# EAGLE design breakout_022218 (EAGLE 8.6.0)
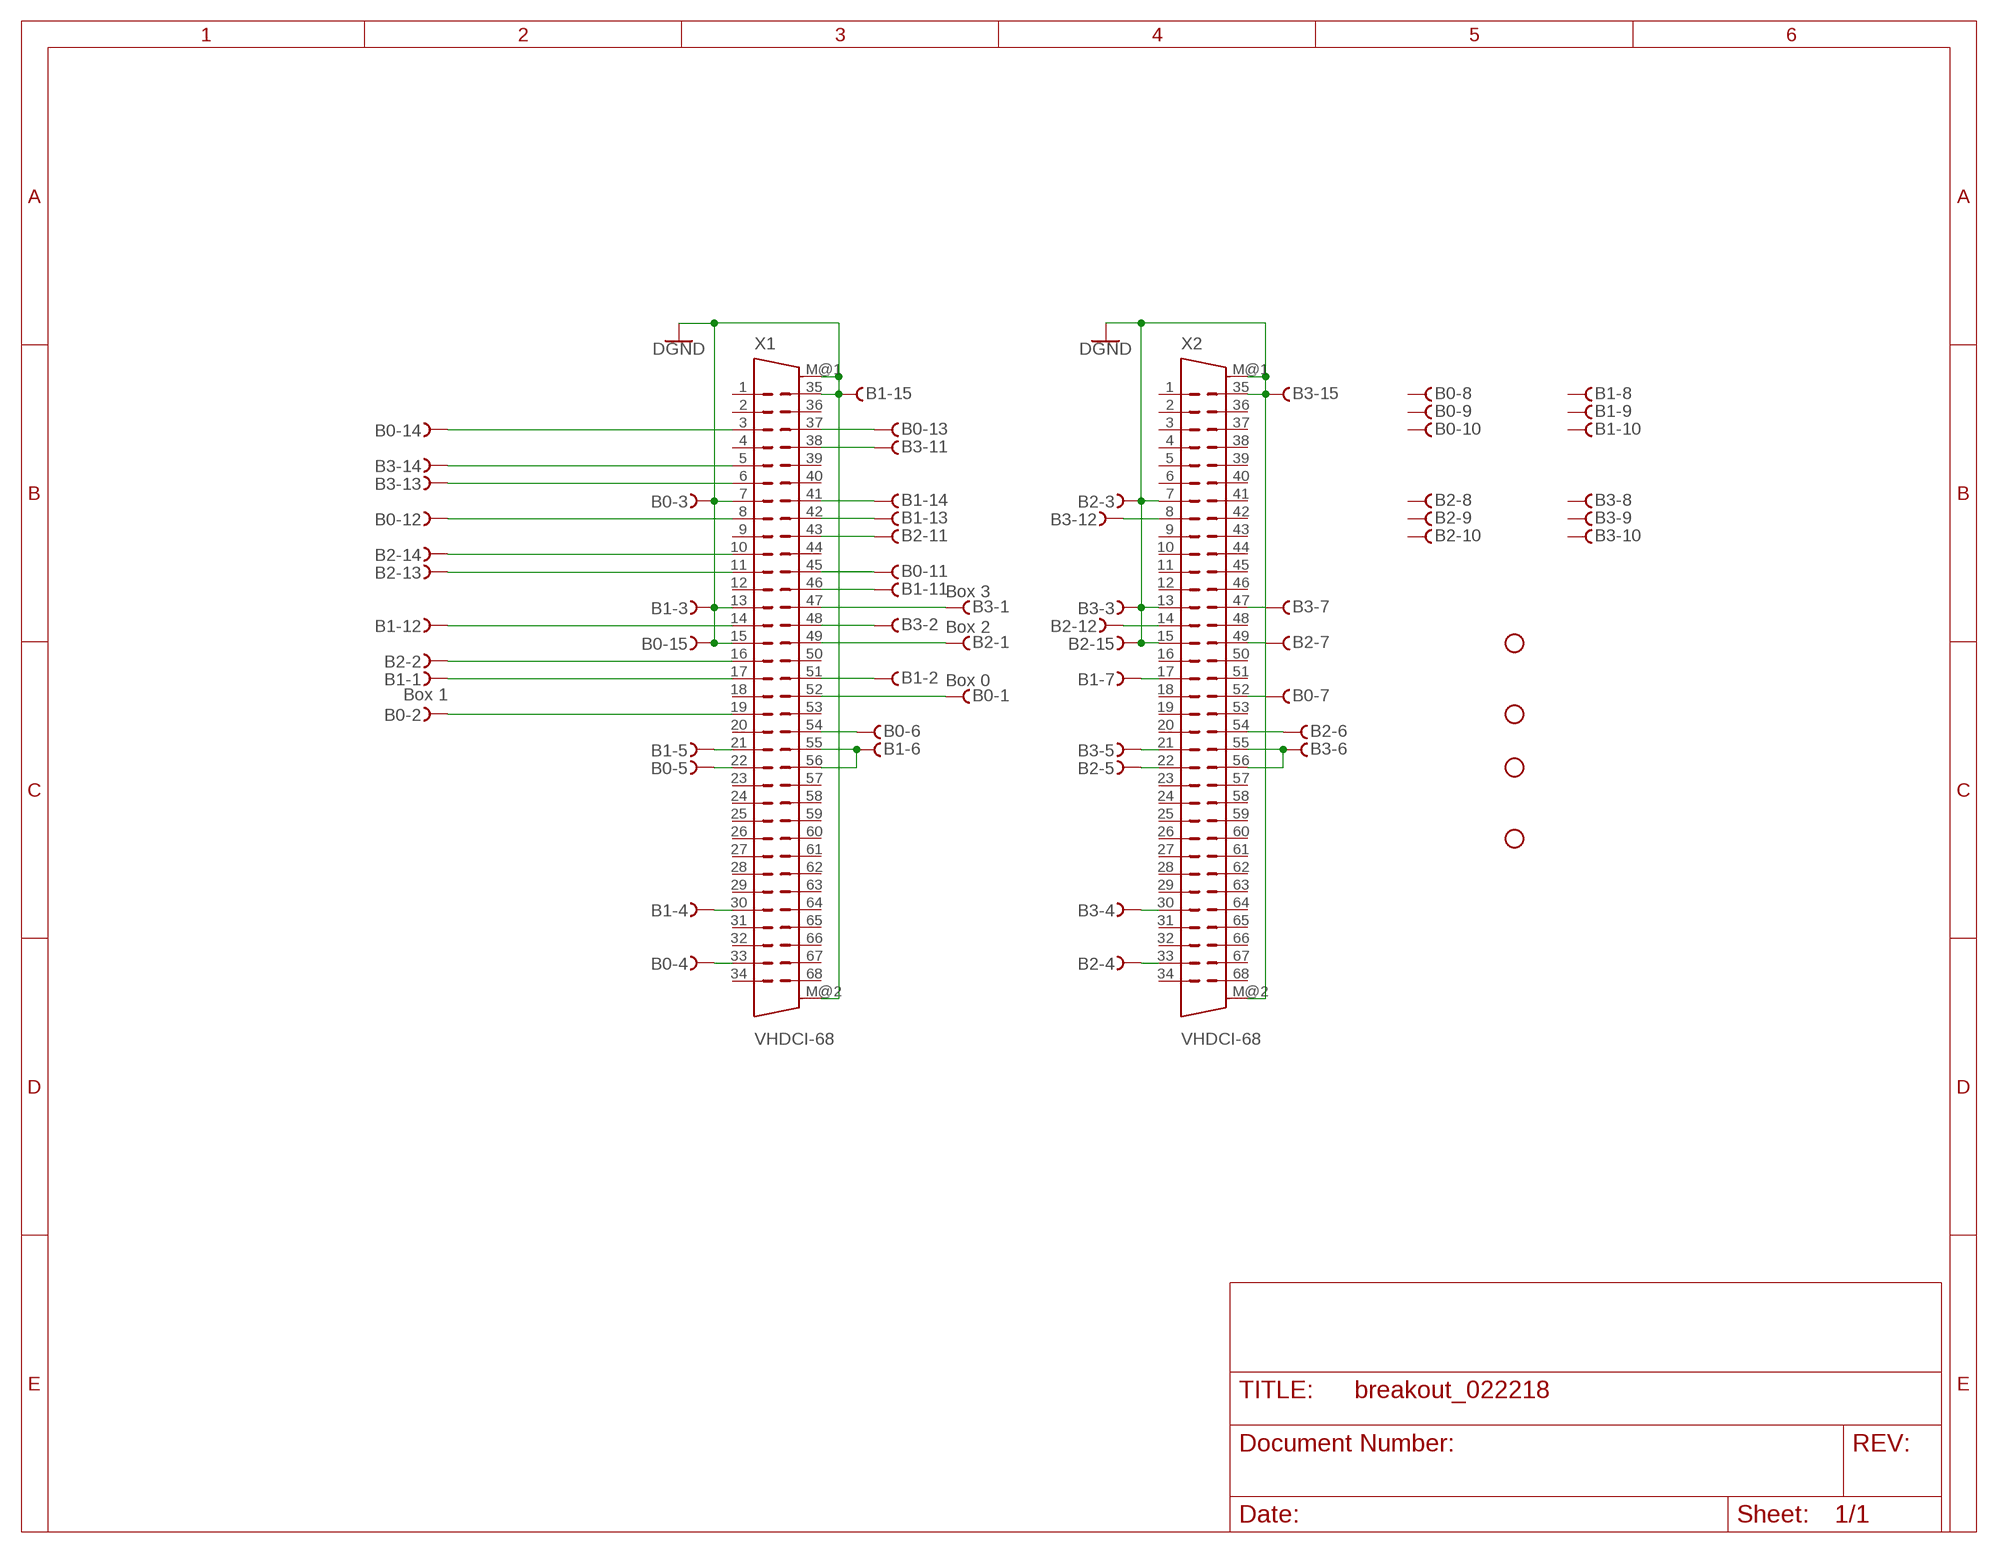
[diagram p0: schematic, sheet 1]

## Parts
B0  Box 0  D-SUB15-HDR15RA  [HDR15RA]
B1  Box 1  D-SUB15-HDR15RA  [HDR15RA]
B2  Box 2  D-SUB15-HDR15RA  [HDR15RA]
B3  Box 3  D-SUB15-HDR15RA  [HDR15RA]
H1  STAND-OFF  [STAND-OFF]
H2  STAND-OFF  [STAND-OFF]
H3  STAND-OFF  [STAND-OFF]
H4  STAND-OFF  [STAND-OFF]
X1  VHDCI-68  [VHDCI-68]
X2  VHDCI-68  [VHDCI-68]

## Nets
GND: B0.3 B0.15 B1.3 B1.15 B2.3 B2.15 B3.3 B3.15 X1.7 X1.13 X1.15 X1.35 X1.M@1(S) X1.M@2(S) X2.7 X2.13 X2.15 X2.35 X2.M@1(S) X2.M@2(S) ; supply symbol labelled DGND
N$1: B0.6 X1.54
N$2: B1.6 X1.55 X1.56
N$3: B2.6 X2.54
N$4: B3.6 X2.55 X2.56
N$5: B0.5 X1.22
N$6: B1.5 X1.21
N$7: B2.5 X2.22
N$8: B3.5 X2.21
N$9: B0.4 X1.33
N$10: B1.4 X1.30
N$11: B2.4 X2.33
N$12: B3.4 X2.30
N$13: B0.1 X1.52
N$14: B1.1 X1.17
N$15: B2.1 X1.49
N$16: B3.1 X1.47
N$17: B0.2 X1.19
N$18: B1.2 X1.51
N$19: B2.2 X1.16
N$20: B3.2 X1.48
N$21: B3.12 X2.8
N$22: B2.12 X2.14
N$25: B0.7 X2.52
N$26: B1.7 X2.17
N$27: B2.7 X2.49
N$28: B3.7 X2.47
N$33: B0.12 X1.8
N$34: B1.12 X1.14
N$37: B0.11 X1.45
N$38: B1.11 X1.46
N$39: B2.11 X1.43
N$40: B3.11 X1.38
N$41: B0.13 X1.37
N$42: B1.13 X1.42
N$43: B2.13 X1.11
N$44: B3.13 X1.6
N$45: B0.14 X1.3
N$46: B1.14 X1.41
N$47: B2.14 X1.10
N$48: B3.14 X1.5
Unconnected: B0.8 B0.9 B0.10 B1.8 B1.9 B1.10 B2.8 B2.9 B2.10 B3.8 B3.9 B3.10 X1.1 X1.2 X1.4 X1.9 X1.12 X1.18 X1.20 X1.23 X1.24 X1.25 X1.26 X1.27 X1.28 X1.29 X1.31 X1.32 X1.34 X1.36 X1.39 X1.40 X1.44 X1.50 X1.53 X1.57 X1.58 X1.59 X1.60 X1.61 X1.62 X1.63 X1.64 X1.65 X1.66 X1.67 X1.68 X2.1 X2.2 X2.3 X2.4 X2.5 X2.6 X2.9 X2.10 X2.11 X2.12 X2.16 X2.18 X2.19 X2.20 X2.23 X2.24 X2.25 X2.26 X2.27 X2.28 X2.29 X2.31 X2.32 X2.34 X2.36 X2.37 X2.38 X2.39 X2.40 X2.41 X2.42 X2.43 X2.44 X2.45 X2.46 X2.48 X2.50 X2.51 X2.53 X2.57 X2.58 X2.59 X2.60 X2.61 X2.62 X2.63 X2.64 X2.65 X2.66 X2.67 X2.68

## Library data of the parts
B0 B1-B3 = con-thomas-betts:D-SUB15-: D-Subminiatur Connector Source: Electronioc Interconnects European Edition 1998; OC_FARNELL: unknown; OC_NEWARK: unknown
H1-H4 = SparkFun-Hardware:STAND-OFF: Stand Off Drill holes for mechanically mounting via screws, standoffs, etc. Note: Use the keepout ring to avoid running the screw head into surrounding components. Variant Overviews STAND-OFF - Mechanical footprint for a #4 phillips button head screw. STAND-OFF-TIGHT - Mechanical footprint for a #4 phillips button head screw, Example SparkFun Products Screw - Phillips Head (1/4", 4-40, 10 pack) <https://www.sparkfun.com/products/10453> (PRT-10453) Screw - Phillips Head (1/2", 4-40, 10 pack) <https://www.sparkfun.com/products/10452> (PRT-10452) Screw - Phillips Head (3/4", 4-40, 10 pack) <https://www.sparkfun.com/products/10451> (PRT-10451) Screw - Phillips Head (1", 4-40, 10 pack) <https://www.sparkfun.com/products/10450> (PRT-10450)
X1 X2 = con-molex:VHDCI-68: VHDCI RIGHT ANGLE ASSEMBLY 68-Pin 73412-0110 86-Pin-VHDCI-Anschluss (rechtwinklig) Source: Data sheet <ftp://ftp.ni.com/ddraw/CU_68-Pin_Right-Angle_VHDCI_Connector.pdf>; MF: MOLEX

## Board
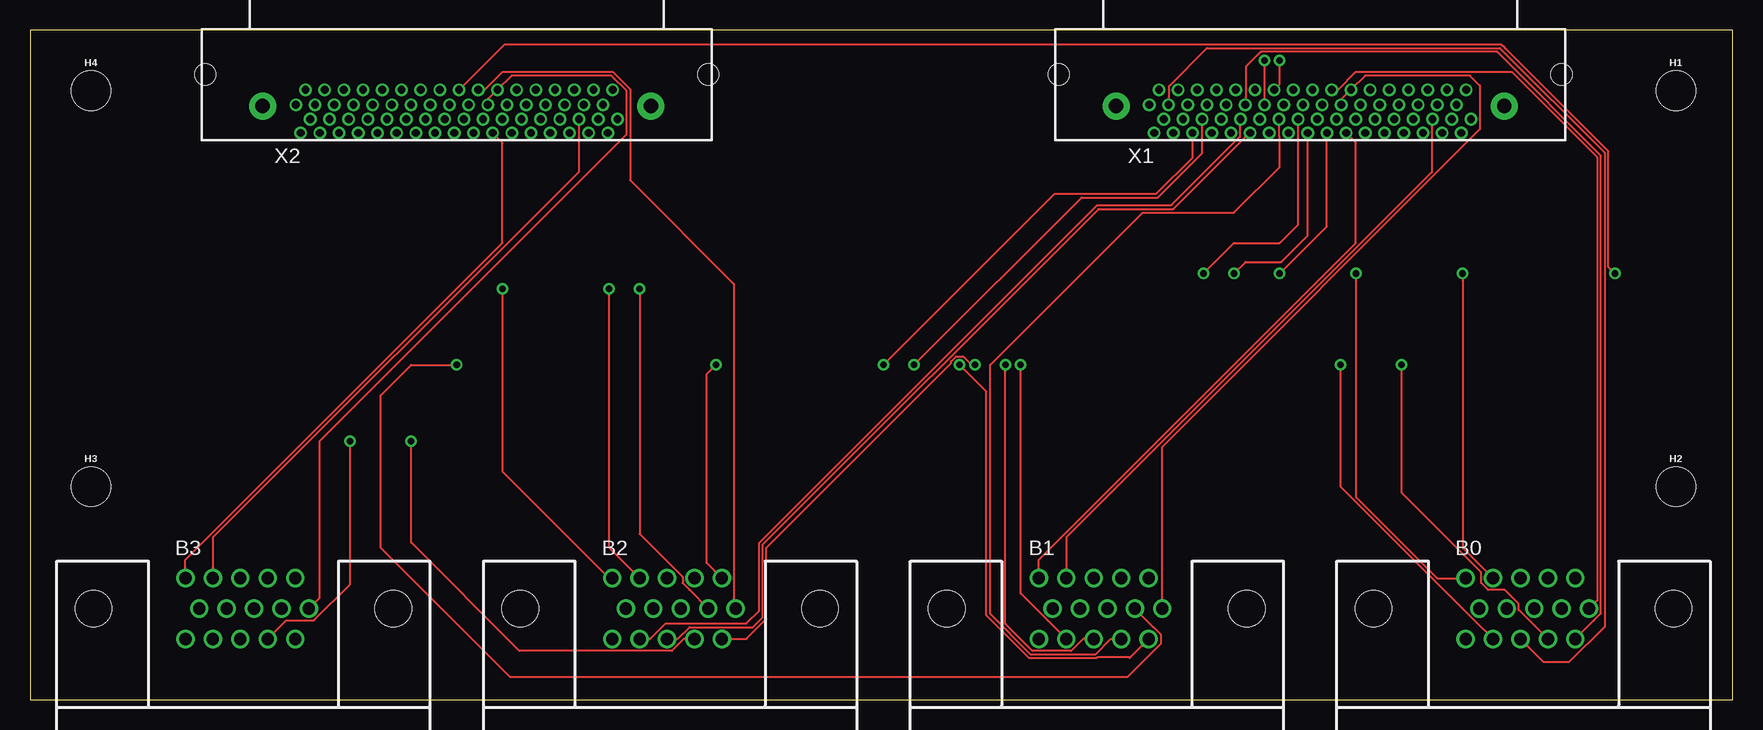
[diagram p1: board, top side]
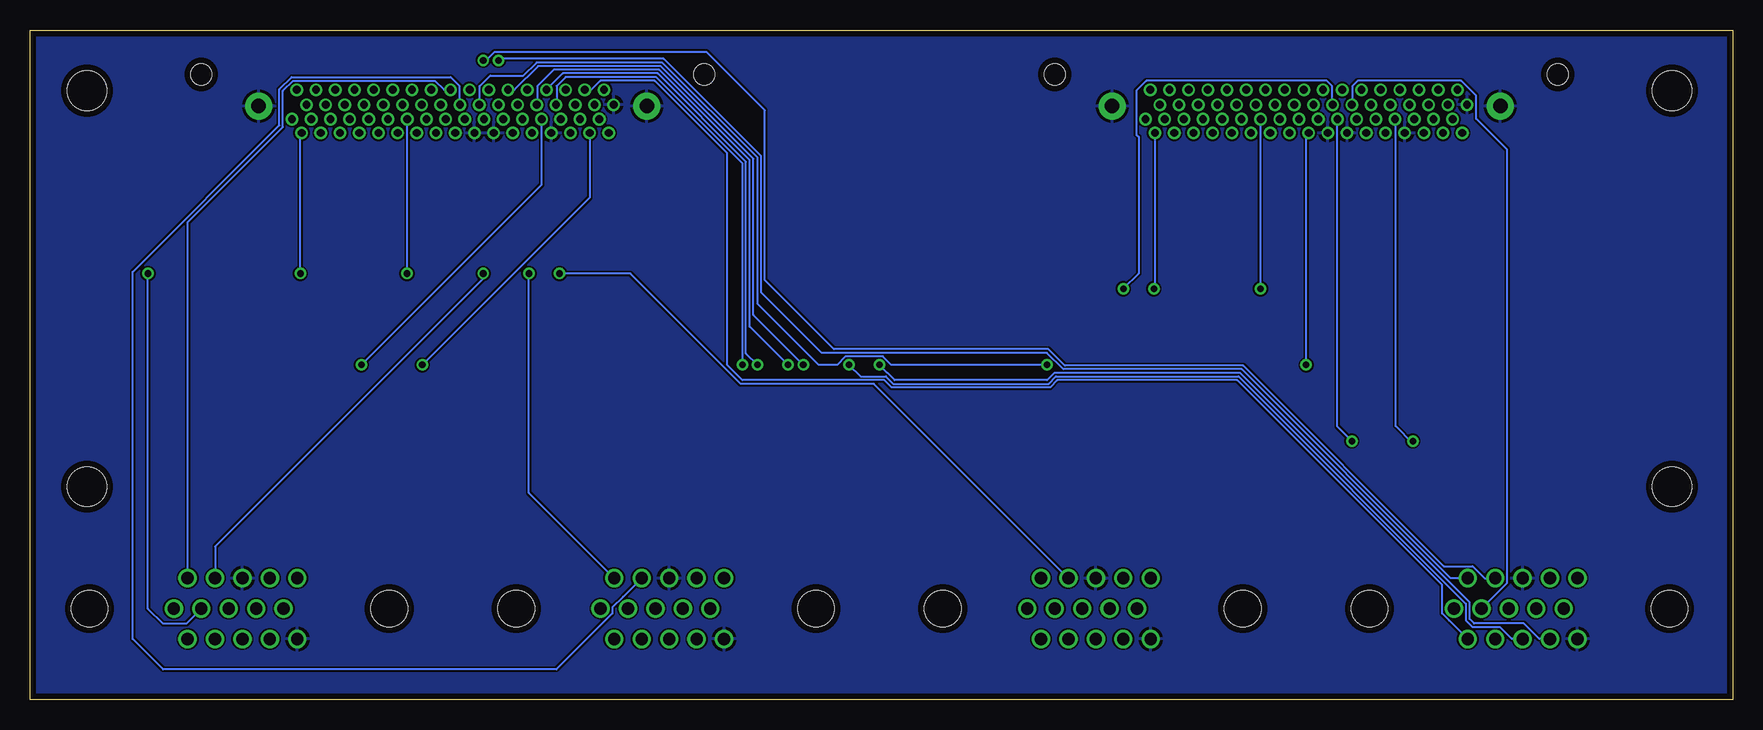
[diagram p2: board, bottom side, seen from below]

Size 141.91 x 55.87 mm. Coordinates in mm from the lower left corner, seen from the top.
Outline: 0,0 141.91,0 141.91,55.87 0,55.87 0,0
Copper layers (1*16): Top 0.0178mm / dielectric 59mil / Bottom 0.0178mm
Design rules "SSC-EAGLE-2Lyr_v1.0.0.3": minimum track width 6mil, minimum drill 14mil, track to track 6mil, track to pad 6mil, pad to pad 6mil, via to via 6mil, smd to smd 6mil, copper to edge 20mil, drill to drill 16mil, minimum pad ring 8mil, minimum via ring 8mil, stop-mask expansion 3mil, vias tented up to drill 0mil, thermal gap 10mil

### Footprints (pad centres in the part's own frame; a part is rotated, then mirrored left to right if it is on the bottom)
HDR15RA = drill 1.016: 1 4.318,2.54; 2 2.032,2.54; 3 -0.254,2.54; 4 -2.54,2.54; 5 -4.826,2.54; 6 5.461,0; 7 3.175,0; 8 0.889,0; 9 -1.397,0; 10 -3.683,0; 11 4.318,-2.54; 12 2.032,-2.54; 13 -0.254,-2.54; 14 -2.54,-2.54; 15 -4.826,-2.54 | hole 3.048: -12.497,0; 12.497,0
STAND-OFF = hole 3.302: 0,0
VHDCI-68 = drill 0.65 pad 1: 1 13.005,2.25; 2 12.205,1.1; 3 11.405,2.25; 4 10.605,1.1; 5 9.805,2.25; 6 9.005,1.1; 7 8.205,2.25; 8 7.405,1.1; 9 6.605,2.25; 10 5.805,1.1; 11 5.005,2.25; 12 4.205,1.1; 13 3.405,2.25; 14 2.605,1.1; 15 1.805,2.25; 16 1.005,1.1; 17 0.205,2.25; 18 -0.595,1.1; 19 -1.395,2.25; 20 -2.195,1.1; 21 -2.995,2.25; 22 -3.795,1.1; 23 -4.595,2.25; 24 -5.395,1.1; 25 -6.195,2.25; 26 -6.995,1.1; 27 -7.795,2.25; 28 -8.595,1.1; 29 -9.395,2.25; 30 -10.195,1.1; 31 -10.995,2.25; 32 -11.795,1.1; 33 -12.595,2.25; 34 -13.395,1.1; 35 13.405,-0.1; 36 12.605,-1.35; 37 11.805,-0.1; 38 11.005,-1.35; 39 10.205,-0.1; 40 9.405,-1.35; 41 8.605,-0.1; 42 7.805,-1.35; 43 7.005,-0.1; 44 6.205,-1.35; 45 5.405,-0.1; 46 4.605,-1.35; 47 3.805,-0.1; 48 3.005,-1.35; 49 2.205,-0.1; 50 1.405,-1.35; 51 0.605,-0.1; 52 -0.195,-1.35; 53 -0.995,-0.1; 54 -1.795,-1.35; 55 -2.595,-0.1; 56 -3.395,-1.35; 57 -4.195,-0.1; 58 -4.995,-1.35; 59 -5.795,-0.1; 60 -6.595,-1.35; 61 -7.395,-0.1; 62 -8.195,-1.35; 63 -8.995,-0.1; 64 -9.795,-1.35; 65 -10.595,-0.1; 66 -11.395,-1.35; 67 -12.195,-0.1; 68 -12.995,-1.35 | drill 1.2 pad 2.25: M@1 -16.175,0; M@2 16.175,0 | hole 1.75: 20.95,-2.63; -20.95,-2.63

### Placement (x,y rotation side)
B0  124.46,7.62 0 top
B1  88.9,7.62 0 top
B2  53.34,7.62 0 top
B3  17.78,7.62 0 top
H1  137.16,50.8 0 top
H2  137.16,17.78 0 top
H3  5.08,17.78 0 top
H4  5.08,50.8 0 top
X1  106.68,49.53 180 top
X2  35.56,49.53 180 top

### Tracks (layer width: path | path; a pad name or v marks a point on that pad's centre or on a via)
GND
  pour Bottom: 0,55.88 142.24,55.88 142.24,0 0,0
N$1
  Top 0.152: X1.54 109.01,50.88 110.5,52.38 123.49,52.38 130.61,45.26 130.61,8.31 B0.6
N$2
  Top 0.152: X1.55 109.28,50.08 X1.56 111.27,52.07 119.99,52.07 120.83,51.23 120.83,47.58 94.36,21.11 B1.6
N$3
  Top 0.152: X2.54 37.88,50.88 39.38,52.38 48.56,52.38 50.02,50.92 50.02,43.33 58.65,34.7 58.65,7.77 B2.6
N$4
  Top 0.152: B3.6 24.13,8.51 24.13,21.59 49.71,47.17 49.71,50.79 48.43,52.07 40.14,52.07 X2.56 38.16,50.08 X2.55
N$5  (via drill 0.55 pad 0.55)
  Top 0.152: v110.49,35.56 110.49,16.94 117.27,10.16 B0.5
  Bottom 0.152: v110.49,35.56 110.48,35.57 X1.22
N$6
  Top 0.152: B1.5 84.07,11.68 110.49,38.1 110.49,46.46 X1.21
N$7  (via drill 0.55 pad 0.55)
  Top 0.152: v39.37,34.29 39.37,19.05 48.26,10.16 B2.5
  Bottom 0.152: X2.22 39.37,48.41 v39.37,34.29
N$8
  Top 0.152: B3.5 12.95,11.68 39.37,38.1 39.37,46.46 X2.21
N$9  (via drill 0.55 pad 0.55)
  Top 0.152: v119.38,35.56 119.38,12.7 B0.4
  Bottom 0.152: v119.38,35.56 119.38,47.17 X1.33
N$10
  Top 0.152: B1.4 86.36,13.54 116.83,44.01 116.83,48.39 X1.30
N$11  (via drill 0.55 pad 0.55)
  Top 0.152: B2.4 48.26,12.7 v48.26,34.29
  Bottom 0.152: v48.26,34.29 48.16,34.39 X2.33
N$12
  Top 0.152: B3.4 15.24,13.54 45.71,44.01 45.71,48.39 X2.30
N$13
  Bottom 0.152: X1.52 107.41,50.88 108.16,51.64 119.99,51.64 120.83,50.79 120.83,47.79 128.78,39.84 B0.1
N$14  (via drill 0.55 pad 0.55)
  Top 0.152: v100.33,35.56 101.3,36.52 104.27,36.52 106.48,38.73 X1.17
  Bottom 0.152: B1.1 100.33,17.27 v100.33,35.56
N$15  (via drill 0.55 pad 0.55)
  Top 0.152: B2.1 56.39,11.43 56.39,27.18 v57.15,27.94
  Bottom 0.152: X1.49 104.43,49.67 104.43,51.19 103.56,52.07 100.79,52.07 99.7,53.16 89.23,53.16 81.28,45.21 81.28,33.02 76.2,27.94 74.66,27.94 73.95,28.65 70.83,28.65 70.12,27.94 v57.15,27.94
N$16  (via drill 0.55 pad 0.55)
  Top 0.152: v102.87,53.34 X1.47
  Bottom 0.152: B3.1 23.52,10.16 40.94,27.58 55.8,27.58 57.16,28.95 75.94,28.95 80.98,33.98 80.98,45.34 89.1,53.47 102.74,53.47 v102.87,53.34
N$17  (via drill 0.55 pad 0.55)
  Top 0.152: v104.14,35.56 108.08,39.49 X1.19
  Bottom 0.152: v104.14,35.56 104.14,35.15 126.49,12.8 B0.2
N$18
  Bottom 0.152: B1.2 92.48,8.61 93.37,7.73 93.37,7.21 98.04,2.54 130.81,2.54 133.35,5.08 133.35,35.7 121.14,47.91 121.14,50.92 120.12,51.94 106.87,51.94 106.12,51.19 106.12,49.67 X1.51
N$19  (via drill 0.55 pad 0.55)
  Top 0.152: v97.79,35.56 100.33,38.1 104.14,38.1 105.68,39.63 X1.16
  Bottom 0.152: B2.2 71.58,26.37 82.68,26.37 91.87,35.56 v97.79,35.56
N$20  (via drill 0.55 pad 0.55)
  Top 0.152: X1.48 104.14,51.34 v104.14,53.34
  Bottom 0.152: B3.2 20.7,10.16 21.69,11.15 24.08,11.15 40.82,27.89 55.67,27.89 57.04,29.26 74.93,29.26 80.67,35 80.67,49.16 85.55,54.05 103.16,54.05 103.87,53.34 v104.14,53.34
N$21  (via drill 0.55 pad 0.55)
  Top 0.152: B3.12 21.36,6.63 23.65,6.63 26.67,9.65 v26.67,21.59
  Bottom 0.152: v26.67,21.59 26.67,21.39 28.11,22.84 28.11,48.39 X2.8
N$22  (via drill 0.55 pad 0.55)
  Top 0.152: B2.12 54.49,5.08 53.5,4.09 40.79,4.09 31.75,13.13 v31.75,21.59
  Bottom 0.152: v31.75,21.59 32.95,22.8 X2.14
N$25  (via drill 0.55 pad 0.55)
  Top 0.152: v132.08,35.56 131.52,36.12 131.52,45.75 122.93,54.34 122.61,54.66 39.53,54.66 X2.52
  Bottom 0.152: B0.7 128.91,6.35 130.81,6.35 132.08,7.62 v132.08,35.56
N$26  (via drill 0.55 pad 0.55)
  Top 0.152: B1.7 93.62,6.07 93.63,6.07 94.21,5.49 94.21,4.67 91.44,1.9 40,1.9 29.21,12.7 29.21,25.4 31.75,27.94 v35.56,27.94
  Bottom 0.152: v35.56,27.94 35.56,47.07 X2.17
N$27  (via drill 0.55 pad 0.55)
  Top 0.152: B2.7 54.97,9.17 54.96,9.17 54.38,9.75 54.38,10.27 50.8,13.85 v50.8,34.29
  Bottom 0.152: X2.49 33.4,49.67 33.4,51.19 33.84,51.64 48.87,51.64 49.71,50.79 49.71,47.14 49.53,46.96 49.53,35.56 v50.8,34.29
N$28
  Bottom 0.152: B3.7 19.41,9.17 19.4,9.17 18.82,9.75 18.82,45.89 21.4,48.46 21.4,50.39 22.64,51.64 31.27,51.64 31.71,51.19 31.71,49.67 X2.47
N$33  (via drill 0.55 pad 0.55)
  Top 0.152: B0.12 124.94,6.63 124.05,7.51 124.05,8.03 122.91,9.17 121.51,9.17 120.93,9.75 120.93,10.64 114.3,17.27 v114.3,27.94
  Bottom 0.152: v114.3,27.94 99.28,42.96 X1.8
N$34
  Top 0.152: X1.14 104.12,48.39 104.12,46.97 104.14,46.95 104.14,44.45 100.33,40.64 92.71,40.64 80.01,27.94 80.01,7.19 83.41,3.78 88.75,3.78 90.05,5.08 B1.12
N$37
  Top 0.152: B0.11 130.33,6.63 130.91,7.21 130.91,45.39 122.25,54.05 102.58,54.05 101.32,52.79 101.32,49.67 X1.45
N$38  (via drill 0.55 pad 0.55)
  Top 0.152: B1.11 91.69,3.56 | 91.69,3.56 91.62,3.48 | v77.47,27.94 79.71,25.71 79.71,7.06 83.29,3.48 88.88,3.48 88.95,3.56 91.69,3.56
  Bottom 0.152: X1.46 101.55,50.88 99.57,52.86 89.35,52.86 81.64,45.14 81.64,32.11 v77.47,27.94
N$39  (via drill 0.55 pad 0.55)
  Top 0.152: B2.11 59.69,5.08 61.37,6.76 61.37,12.69 76.76,28.09 76.76,28.23 77.18,28.65 77.76,28.65 78.47,27.94 v78.74,27.94
  Bottom 0.152: X1.43 99.63,49.67 99.63,51.19 98.27,52.55 89.48,52.55 81.94,45.01 81.94,31.14 v78.74,27.94
N$40
  Bottom 0.152: B3.11 23.65,6.63 24.23,7.21 24.23,9.58 41.32,26.67 56.29,26.67 56.9,26.06 70.1,26.06 70.71,26.67 82.55,26.67 83.82,27.94 83.82,45.6 89.86,51.64 94.39,51.64 95.15,50.88 X1.38
N$41
  Top 0.152: X1.37 94.92,49.67 94.92,50.8 94.92,51.19 98.08,54.35 122.49,54.35 131.22,45.62 131.22,6.12 128.27,3.17 126.12,3.17 B0.13
N$42  (via drill 0.55 pad 0.55)
  Top 0.152: B1.13 87.76,5.08 86.77,4.09 83.54,4.09 81.28,6.35 v81.28,27.94
  Bottom 0.152: v81.28,27.94 82.25,28.91 82.25,44.89 89.61,52.25 97.51,52.25 X1.42 98.78,50.88
N$43
  Top 0.152: B2.13 53.97,5.08 54.96,6.07 60.25,6.07 61.06,6.88 61.06,12.7 61.06,12.82 61.06,12.96 89.04,40.95 95.25,40.95 101.59,47.28 X1.11
N$44  (via drill 0.55 pad 0.55)
  Top 0.152: v73.66,27.94 87.63,41.91 93.98,41.91 97.68,45.6 X1.6
  Bottom 0.152: 73.36,27.64 v73.66,27.94 72.7,26.98 70.59,26.98 69.98,26.37 57.02,26.37 56.41,26.98 41.2,26.98 22.25,8.03 | B3.13 18.41,5.08 19.4,6.07 21.69,6.07 22.25,6.63 22.25,8.03 | 22.25,8.03
N$45  (via drill 0.55 pad 0.55)
  Top 0.152: B0.14 120.37,6.63 109.22,17.78 v109.22,27.94
  Bottom 0.152: X1.3 95.28,41.88 v109.22,27.94
N$46  (via drill 0.55 pad 0.55)
  Top 0.152: B1.14 84.81,6.63 82.55,8.89 v82.55,27.94
  Bottom 0.152: v82.55,27.94 82.55,44.76 89.38,51.59 89.43,51.64 89.73,51.94 97.28,51.94 98.03,51.19 98.03,49.67 X1.41
N$47
  Top 0.152: X1.10 100.83,48.39 100.83,46.97 95.12,41.25 88.92,41.25 60.76,13.09 60.76,12.95 60.76,12.7 60.76,7.44 59.69,6.38 52.98,6.38 51.68,5.08 B2.14
N$48  (via drill 0.55 pad 0.55)
  Top 0.152: v71.12,27.94 85.4,42.21 93.85,42.21 96.88,45.24 X1.5
  Bottom 0.152: 70.46,27.28 v71.12,27.94 69.85,26.67 57.15,26.67 56.54,27.28 41.07,27.28 40.55,26.76 21.95,8.16 21.95,6.76 21.56,6.38 17.42,6.38 16.12,5.08 B3.14